# Altium project NODE.PrjPcb
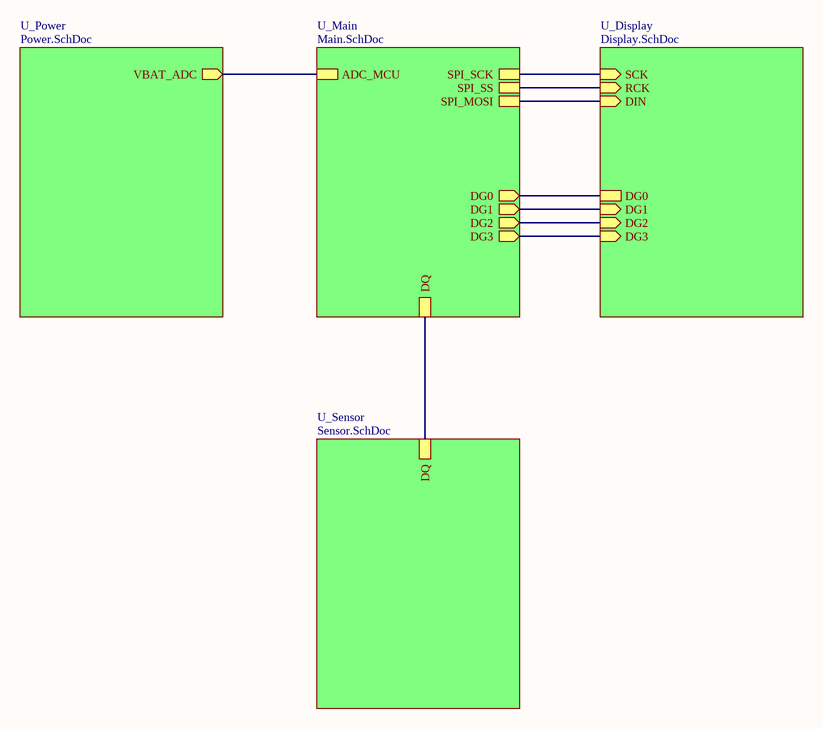
[diagram p0: CONN.SchDoc]
5 sheets, 69 parts. Net scope: hierarchical (ports join the sheet entries above them; power ports are global).
Board file: NODE.PcbDoc
Sheets:
  CONN.SchDoc
    U_Display = Display.SchDoc
    U_Power = Power.SchDoc
    U_Main = Main.SchDoc
    U_Sensor = Sensor.SchDoc

## Sheet CONN.SchDoc
size A3; SheetNumber: 1; SheetTotal: 5

### Sub-sheets
U_Display = Display.SchDoc: DIN (in), RCK (in), SCK (in), DG0, DG1 (in), DG2 (in), DG3 (in)
U_Main = Main.SchDoc: DQ, DG0 (out), DG1 (out), DG2 (out), DG3 (out), ADC_MCU, SPI_SCK, SPI_MOSI, SPI_SS
U_Power = Power.SchDoc: VBAT_ADC (out)
U_Sensor = Sensor.SchDoc: DQ

### Nets
p1.00: sheet U_Display/DG0, sheet U_Main/DG0
p1.01: sheet U_Display/DG1, sheet U_Main/DG1
p1.02: sheet U_Display/DG2, sheet U_Main/DG2
p1.03: sheet U_Display/DG3, sheet U_Main/DG3
NetC13_2: sheet U_Power/VBAT_ADC, sheet U_Main/ADC_MCU
NetIC1_2: sheet U_Main/DQ, sheet U_Sensor/DQ
NetU1_9: sheet U_Display/DIN, sheet U_Main/SPI_MOSI
NetU1_11: sheet U_Display/RCK, sheet U_Main/SPI_SS
NetU1_46: sheet U_Display/SCK, sheet U_Main/SPI_SCK

## Sheet Display.SchDoc
size A; SheetNumber: 3; SheetTotal: 4
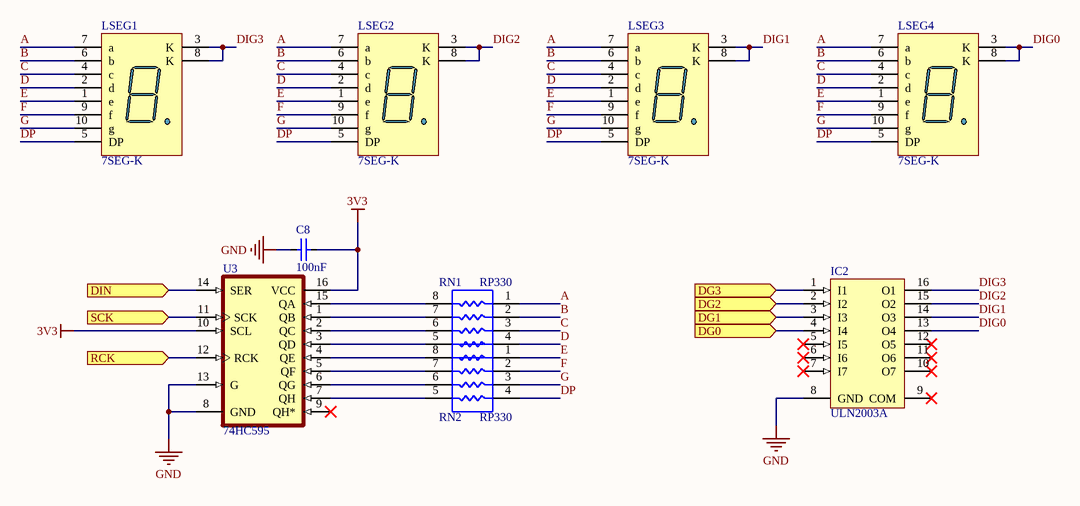
[diagram p1: Display.SchDoc]

### Parts
C8  100nF  [CAP_0805]
IC2  ULN2003A  [SOIC16]
LSEG1  7SEG-K  [LED7SEG]
LSEG2  7SEG-K  [LED7SEG]
LSEG3  7SEG-K  [LED7SEG]
LSEG4  7SEG-K  [LED7SEG]
RN1  RP330  [RN4-0805]
RN2  RP330  [RN4-0805]
U3  74HC595  [SOIC16]

### Ports
DG0 (in), DG1 (in), DG2 (in), DG3 (in), DIN (in), RCK (in), SCK (in)

### Nets
3V3: C8.1 U3.10(SCL) U3.16(VCC)
GND: C8.2 IC2.8(GND) U3.8(GND) U3.13(G)
A: LSEG1.7(a) LSEG2.7(a) LSEG3.7(a) LSEG4.7(a) RN1.1
B: LSEG1.6(b) LSEG2.6(b) LSEG3.6(b) LSEG4.6(b) RN1.2
C: LSEG1.4(c) LSEG2.4(c) LSEG3.4(c) LSEG4.4(c) RN1.3
D: LSEG1.2(d) LSEG2.2(d) LSEG3.2(d) LSEG4.2(d) RN1.4
DIG0: IC2.13(O4) LSEG4.3(K) LSEG4.8(K)
DIG1: IC2.14(O3) LSEG3.3(K) LSEG3.8(K)
DIG2: IC2.15(O2) LSEG2.3(K) LSEG2.8(K)
DIG3: IC2.16(O1) LSEG1.3(K) LSEG1.8(K)
DP: LSEG1.5(DP) LSEG2.5(DP) LSEG3.5(DP) LSEG4.5(DP) RN2.4
E: LSEG1.1(e) LSEG2.1(e) LSEG3.1(e) LSEG4.1(e) RN2.1
F: LSEG1.9(f) LSEG2.9(f) LSEG3.9(f) LSEG4.9(f) RN2.2
G: LSEG1.10(g) LSEG2.10(g) LSEG3.10(g) LSEG4.10(g) RN2.3
p1.00: IC2.4(I4) ; port DG0
p1.01: IC2.3(I3) ; port DG1
p1.02: IC2.2(I2) ; port DG2
p1.03: IC2.1(I1) ; port DG3
NetRN1_5: RN1.5 U3.3(QD)
NetRN1_6: RN1.6 U3.2(QC)
NetRN1_7: RN1.7 U3.1(QB)
NetRN1_8: RN1.8 U3.15(QA)
NetRN2_5: RN2.5 U3.7(QH)
NetRN2_6: RN2.6 U3.6(QG)
NetRN2_7: RN2.7 U3.5(QF)
NetRN2_8: RN2.8 U3.4(QE)
NetU1_9: U3.14(SER) ; port DIN
NetU1_11: U3.12(RCK) ; port RCK
NetU1_46: U3.11(SCK) ; port SCK

Not connected (* = marked no-connect by the designer): IC2 5(I5)* 6(I6)* 7(I7)* 9(COM)* 10(O7)* 11(O6)* 12(O5)*; U3 9(QH*)*

### Library data of the parts
C8 = CapSMD: Capacitor; Value: 33p; Published: 8-Jun-2000; LatestRevisionDate: 17-Jul-2002; LatestRevisionNote: Re-released for DXP Platform.; PackageReference: RAD-0.3; Publisher: Altium Limited
IC2 = ULN2003A: High-Voltage, High-Current Darlington Array; LatestRevisionNote: Stylized 3D Model Added.; Publisher: Altium Limited; Value: ULN2003A
LSEG1-LSEG4 = LED7SEG-K: 14.2 mm General Purpose Blue 7-Segment Display: CC, RH DP, Gray Surface; MinimumIntensity: 2020 ucd; Note: IF = 10 mA; Published: 8-Jun-2000; LatestRevisionDate: 17-Dec-2003; LatestRevisionNote: Schematic revised, PCB Footprint replaced.; DatasheetDocument: 24-Sep-2002; PackageDocument: 24-Sep-2002; PackageReference: H; Publisher: Altium Limited; Colour: Blue; ComponentLink1Description: Manufacturer Link; ComponentLink1URL: http://www.agilent.com/
RN1 RN2 = RN4-Dual
U3 = 74HC595: 8-bit Serial-Input/Serial or Parallel Output Shift Register with Latched 3-state Outputs

## Sheet Power.SchDoc
size A3; SheetNumber: 5; SheetTotal: 5
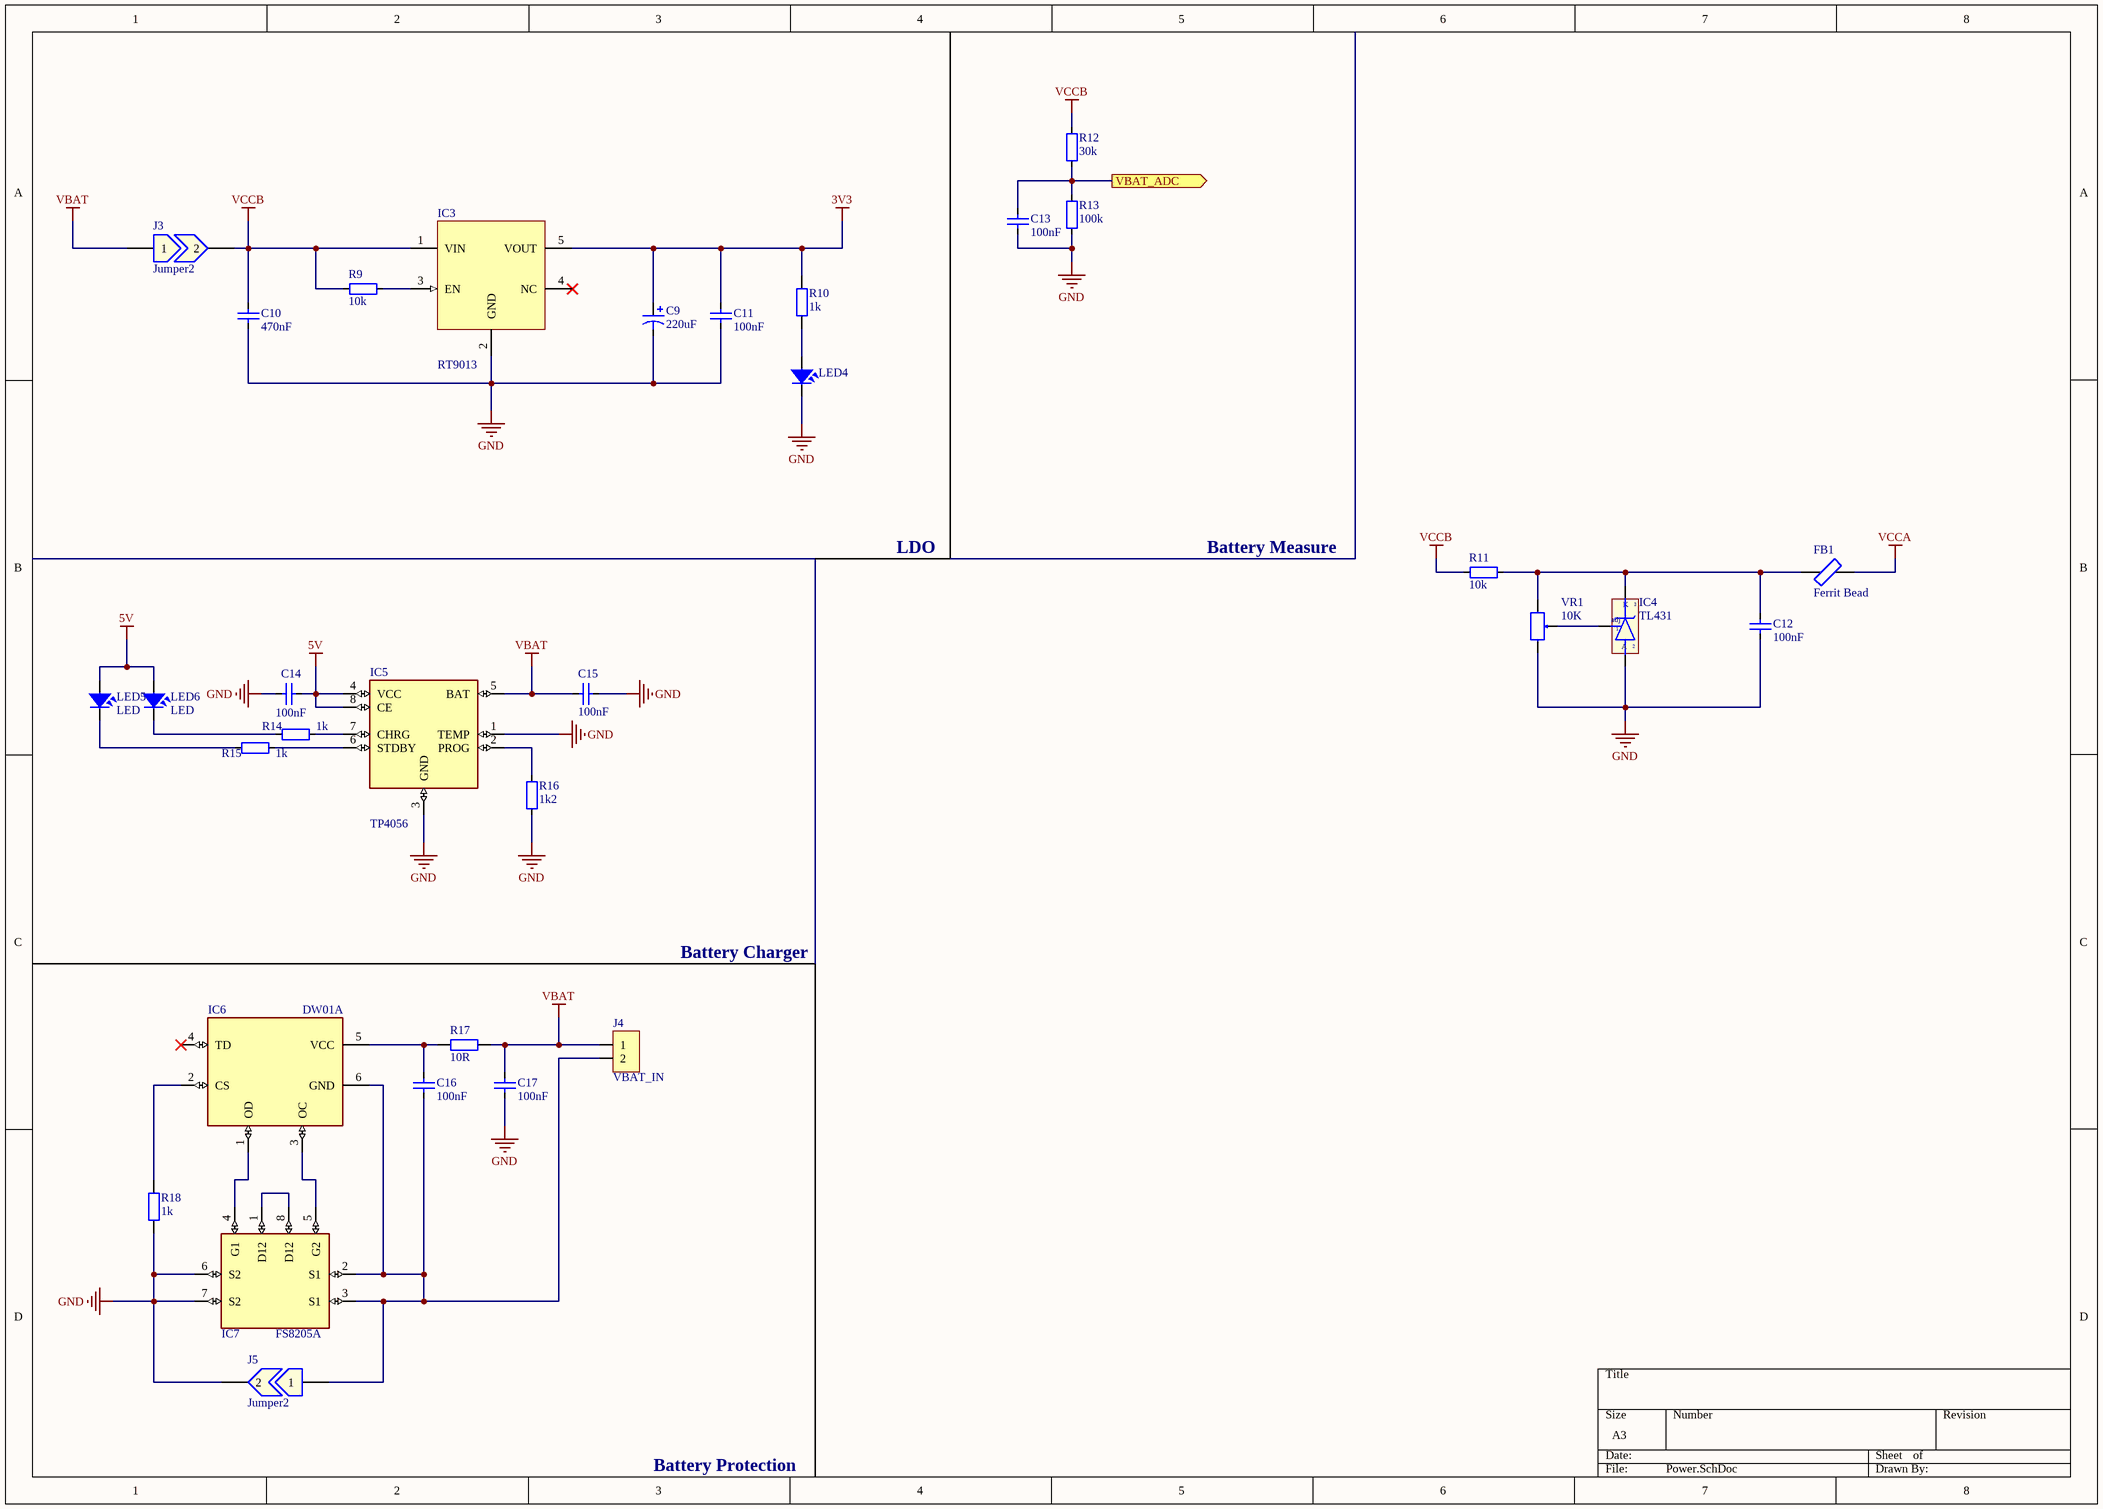
[diagram p2: Power.SchDoc]

### Parts
C9  220uF  [CAP_TANTALUM_3216]
C10  470nF  [CAP_0805]
C11  100nF  [CAP_0805]
C12  100nF  [CAP_0805]
C13  100nF  [CAP_0805]
C14  100nF  [CAP_0805]
C15  100nF  [CAP_0805]
C16  100nF  [CAP_0805]
C17  100nF  [CAP_0805]
FB1  Ferrit Bead  [RES-SMD-0805]
IC3  RT9013  [SOT23-5]
IC4  TL431  [qto-92]
IC5  TP4056  [TP4056]
IC6  DW01A  [SOT23-6]
IC7  FS8205A  [FS8205A]
J3  Jumper2  [JUMPER2]
J4  VBAT_IN  [JP2-D1T]
J5  Jumper2  [JUMPER2]
LED4  (no value)  [LED-0805-Red]
LED5  LED  [LED-0805-Red]
LED6  LED  [LED-0805-Green]
R9  10k  [RES-SMD-0805]
R10  1k  [RES-SMD-0805]
R11  10k  [RES-SMD-0805]
R12  30k  [RES-SMD-0805]
R13  100k  [RES-SMD-0805]
R14  1k  [RES-SMD-0805]
R15  1k  [RES-SMD-0805]
R16  1k2  [RES-SMD-0805]
R17  10R  [RES-SMD-0805]
R18  1k  [RES-SMD-0805]
VR1  10K  [VR1]

### Ports
VBAT_ADC (out)

### Nets
3V3: C9.1 C11.1 IC3.5(VOUT) R10.2
5V: C14.1 IC5.4(VCC) IC5.8(CE) LED5.1 LED6.1
GND: C9.2 C10.2 C11.2 C12.2 C13.1 C14.2 C15.1 C17.1 IC3.2(GND) IC4.2(A) IC5.1(TEMP) IC5.3(GND) IC7.6(S2) IC7.7(S2) J5.2 LED4.2 R13.2 R16.1 R18.2 VR1.3
VBAT: C15.2 C17.2 IC5.5(BAT) J3.1 J4.1 R17.2
VCCA: FB1.2
VCCB: C10.1 IC3.1(VIN) J3.2 R9.2 R11.2 R12.1
NetC12_1: C12.1 FB1.1 IC4.3(K) R11.1 VR1.1
NetC13_2: C13.2 R12.2 R13.1 ; port VBAT_ADC
NetC16_1: C16.1 IC6.6(GND) IC7.2(S1) IC7.3(S1) J4.2 J5.1
NetC16_2: C16.2 IC6.5(VCC) R17.1
NetIC3_3: IC3.3(EN) R9.1
NetIC4_1: IC4.1(adj) VR1.2
NetIC5_2: IC5.2(PROG) R16.2
NetIC5_6: IC5.6(STDBY) R15.1
NetIC5_7: IC5.7(CHRG) R14.1
NetIC6_1: IC6.1(OD) IC7.4(G1)
NetIC6_2: IC6.2(CS) R18.1
NetIC6_3: IC6.3(OC) IC7.5(G2)
NetIC7_1: IC7.1(D12) IC7.8(D12)
NetLED4_1: LED4.1 R10.1
NetLED5_2: LED5.2 R15.2
NetLED6_2: LED6.2 R14.2

Not connected (* = marked no-connect by the designer): IC3 4(NC)*; IC6 4(TD)*

### Notes on the sheet
- LDO
- Battery Measure
- Battery Charger
- Battery Protection

### Library data of the parts
C9 = Cap Pol: Polarized Capacitor (Axial); Published: 8-Jun-2000; LatestRevisionDate: 17-Jul-2002; LatestRevisionNote: Re-released for DXP Platform.; PackageReference: POLAR0.8; Publisher: Altium Limited
C10-C17 = CapSMD: Capacitor; Value: 33p; Published: 8-Jun-2000; LatestRevisionDate: 17-Jul-2002; LatestRevisionNote: Re-released for DXP Platform.; PackageReference: RAD-0.3; Publisher: Altium Limited
FB1 = Ferrit Bead: Generic Ferrit Bead
IC3 = RT9013: https://linhkien.cxt.vn/5435-rt9013-33gb-ic-reg-linear-33v-500ma-sot23-5.html
IC4 = TL431: Programmable Shunt Regulator; Value: TL431
IC5 = TP4056: Complete single cell Li-Ion battery with a constant current / constant voltage linear charger
IC6 = DW01A: One Cell Lithium-ion/Polymer Battery Protection IC
J3 J5 = Jumper2: Jumper, 2-Pin
J4 = JP2: WR-PHD 2.54 mm Angled Socket Header; Manufacturer: W¨¹rth Elektronik eiSos GmbH; partNo: 613002143121; ComponentLink1 Description: Manufacturer; ComponentLink2 Description: Datasheet; NoPins: 02; Created Date: 29 March 2013; ComponentLink1URL: http://www.we-online.com; ComponentLink2URL: http://katalog.we-online.de/em/datasheet/6130xx143121.pdf; Created by: Karrer Zheng
LED4-LED6 = LED: LED Single colour Green and Red; Value: LED 3 ly Single Colour
R9 R11-R16 = Resistor - SMD: Resistor; Manufacturer: Generic Components; Class: Passive; Published: 08/06/2000; Publisher: Altium Hobart Technology Centre
R10 R17 R18 = Resistor - SMD: Resistor SMD; Manufacturer: Generic Components; Class: Passive; Published: 08/06/2000; Publisher: Altium Hobart Technology Centre
VR1 = VR: Var Resistor; Value: VR 10K

## Sheet Main.SchDoc
size A; SheetNumber: 2; SheetTotal: 5
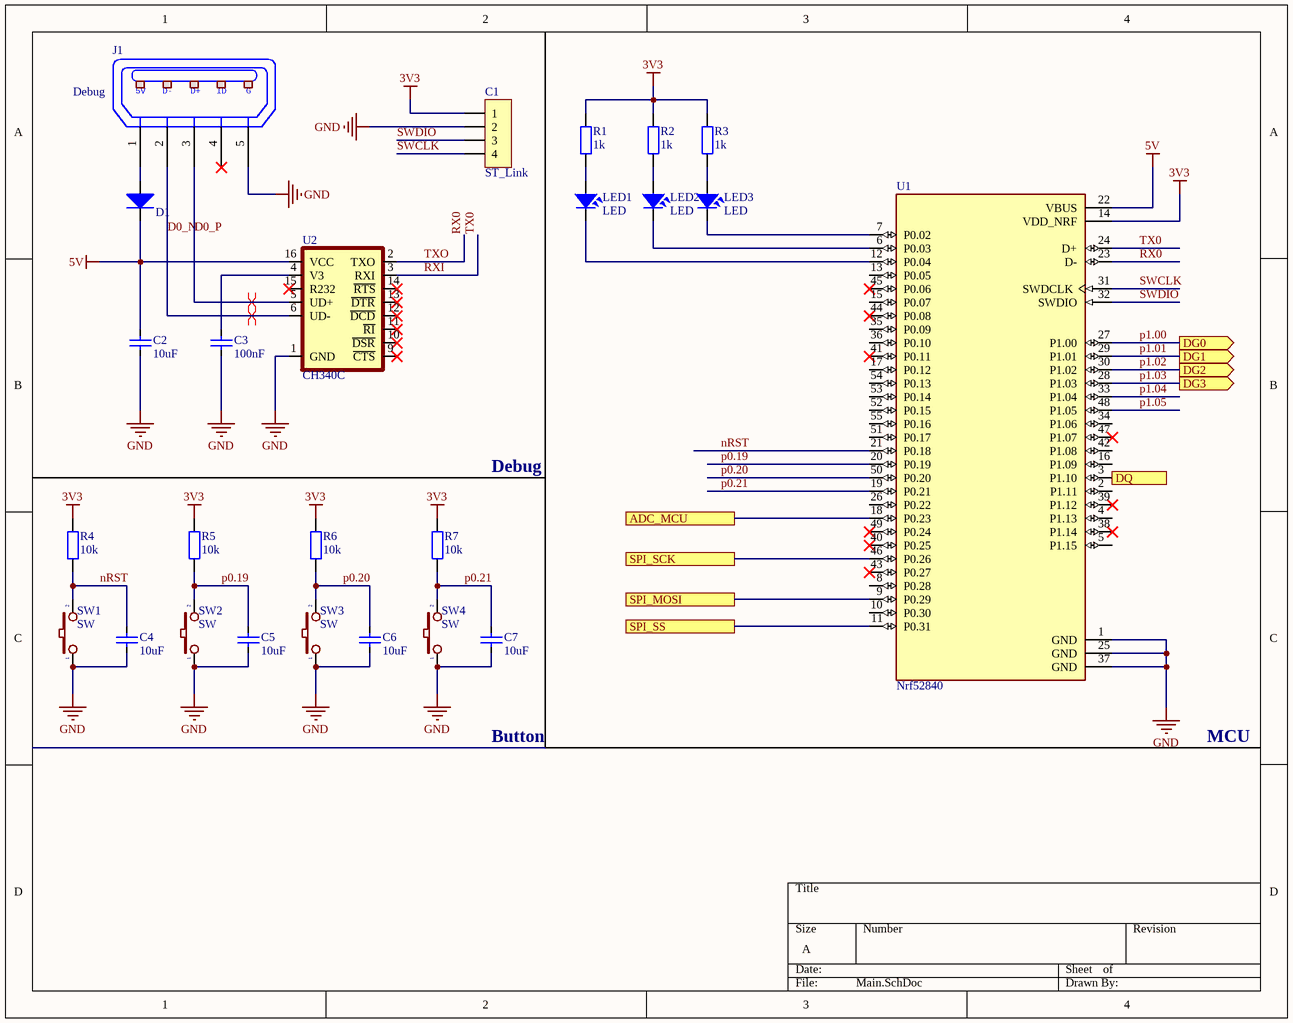
[diagram p3: Main.SchDoc]

### Parts
C1  ST_Link  [J4-D1T]
C2  10uF  [CAP_0805]
C3  100nF  [CAP_0805]
C4  10uF  [CAP_0805]
C5  10uF  [CAP_0805]
C6  10uF  [CAP_0805]
C7  10uF  [CAP_0805]
D1  Diode SMD  [DIO-214AC(SMA)]  (value not drawn)
J1  Debug  [USB-M1]
LED1  LED  [LED-0805-Red]
LED2  LED  [LED-0805-Yellow]
LED3  LED  [LED-0805-Green]
R1  1k  [RES-SMD-0805]
R2  1k  [RES-SMD-0805]
R3  1k  [RES-SMD-0805]
R4  10k  [RES-SMD-0805]
R5  10k  [RES-SMD-0805]
R6  10k  [RES-SMD-0805]
R7  10k  [RES-SMD-0805]
SW1  SW  [SW 3x2x4]
SW2  SW  [SW2]
SW3  SW  [SW2]
SW4  SW  [SW2]
U1  Nrf52840  [NRF52840]
U2  CH340C  [SOP-16]

### Ports
ADC_MCU, DG0 (out), DG1 (out), DG2 (out), DG3 (out), DQ, SPI_MOSI, SPI_SCK, SPI_SS

### Nets
3V3: C1.1 R1.1 R2.1 R3.1 R4.1 R5.1 R6.1 R7.1 U1.14(VDD_NRF)
5V: C2.2 D1.2(K) U1.22(VBUS) U2.16(VCC)
GND: C1.2 C2.1 C3.1 C4.1 C5.1 C6.1 C7.1 J1.5(P5) SW1.1 SW2.1 SW3.1 SW4.1 U1.1(GND) U1.25(GND) U1.37(GND) U2.1(GND)
D0_N: J1.2(P2) U2.6(UD-)
D0_P: J1.3(P3) U2.5(UD+)
nRST: C4.2 R4.2 SW1.2 U1.21(P0.18)
p0.19: C5.2 R5.2 SW2.2 U1.20(P0.19)
p0.20: C6.2 R6.2 SW3.2 U1.50(P0.20)
p0.21: C7.2 R7.2 SW4.2 U1.19(P0.21)
p1.00: U1.27(P1.00) ; port DG0
p1.01: U1.29(P1.01) ; port DG1
p1.02: U1.30(P1.02) ; port DG2
p1.03: U1.28(P1.03) ; port DG3
p1.04: U1.33(P1.04)
p1.05: U1.48(P1.05)
RX0: U1.23(D-) U2.2(TXO)  [also labelled TXO]
RXI: U1.24(D+) U2.3(RXI)  [also labelled TX0]
SWCLK: C1.4 U1.31(SWDCLK)
SWDIO: C1.3 U1.32(SWDIO)
NetC3_2: C3.2 U2.4(V3)
NetC13_2: U1.18(P0.23) ; port ADC_MCU
NetD1_1: D1.1(A) J1.1(P1)
NetIC1_2: U1.3(P1.10) ; port DQ
NetLED1_1: LED1.1 R1.2
NetLED1_2: LED1.2 U1.12(P0.04)
NetLED2_1: LED2.1 R2.2
NetLED2_2: LED2.2 U1.6(P0.03)
NetLED3_1: LED3.1 R3.2
NetLED3_2: LED3.2 U1.7(P0.02)
NetU1_9: U1.9(P0.29) ; port SPI_MOSI
NetU1_11: U1.11(P0.31) ; port SPI_SS
NetU1_46: U1.46(P0.26) ; port SPI_SCK

Not connected (* = marked no-connect by the designer): J1 4(P4)*; U1 2(P1.11) 4(P1.13) 5(P1.15) 8(P0.28) 10(P0.30) 13(P0.05) 15(P0.07) 16(P1.09) 17(P0.12) 26(P0.22) 34(P1.06) 35(P0.09) 36(P0.10) 38(P1.14)* 39(P1.12)* 40(P0.25)* 41(P0.11)* 42(P1.08) 43(P0.27)* 44(P0.08)* 45(P0.06)* 47(P1.07)* 49(P0.24)* 51(P0.17) 52(P0.15) 53(P0.14) 54(P0.13) 55(P0.16); U2 9(~{CTS})* 10(~{DSR})* 11(~{RI})* 12(~{DCD})* 13(~{DTR})* 14(~{RTS})* 15(R232)*

### Layout directives
differential pair: D0_N, D0_P

### Notes on the sheet
- Debug
- Button
- MCU
- (in symbol USB-5) 5V; D-; D+; ID; G

### Library data of the parts
C1 = JP4x1-2.0: WR-PHD 2.00 mm Socket Header; Manufacturer: W¨¹rth Elektronik eiSos GmbH; partNo: 62000411821; ComponentLink1 Description: Manufacturer; ComponentLink2 Description: Datasheet; NoPins: 04; Created Date: 2 April 2013; ComponentLink1URL: http://www.we-online.com; ComponentLink2URL: http://katalog.we-online.de/em/datasheet/6200xx11821.pdf; Created by: Karrer Zheng
C2-C7 = CapSMD: Capacitor; Value: 33p; Published: 8-Jun-2000; LatestRevisionDate: 17-Jul-2002; LatestRevisionNote: Re-released for DXP Platform.; PackageReference: RAD-0.3; Publisher: Altium Limited
D1 = Diode SMD: Default Diode; Code - JEDEC: DO-214-AB; Value: 1N5007; Published: 8-Jun-2000; Revision: July-2002: Re-released for DXP Platform.; Publisher: Altium Limited
J1 = USB-5: Manufacturer: FCI; Manufacturer Part Number: 10118193-0001LF; Connector Type: USB - micro B; Number of Contacts: 5; Gender: Receptacle; Specifications: USB 2.0; .Creator: MM; .Checked PCB: RF; Supplier 1: Digi-Key; RoHS: RoHS Compliant; Category: Connectors, Interconnects; Stock 1: 28642; Pricing 1: 1=0.46, 10=0.433, 25=0.3712, 50=0.3156, 100=0.3032, 250=0.27224, 500=0.25988 (USD); Packaging: Cut Tape (CT); Mounting Type: Surface Mount, Right Angle, Horizontal; Features: Shielded, Solder Retention; Ingress Protection: -; ComponentLink1URL: http://portal.fciconnect.com/Comergent//fci/drawing/10118193.pdf; ComponentLink1Description: http://portal.fciconnect.com/Comergent//fci/drawing/10118193.pdf; Supplier Part Number 1: 609-4616-1-ND; .Checked SCH: MM
LED1-LED3 = LED: as LED4 on sheet Power
R1-R7 = Resistor - SMD: as R10 on sheet Power; Published: 08/06/2000; Publisher: Altium Hobart Technology Centre
SW1-SW4 = SW2: Switch button 2 pin; Value: SW chip 2 pin
U1 = Nrf52840: Module SoC
U2 = CH340C: USB to serial chip CH340; MF: WCH; Package: Package; Check_prices: https://www.snapeda.com/parts/CH340C/WCH/view-part/5428851/?ref=eda; Value: *; Price: None; MP: CH340C; Availability: Unavailable; SnapEDA_Link: https://www.snapeda.com/parts/CH340C/WCH/view-part/5428851/?ref=snap

## Sheet Sensor.SchDoc
size A; SheetNumber: 3; SheetTotal: 5
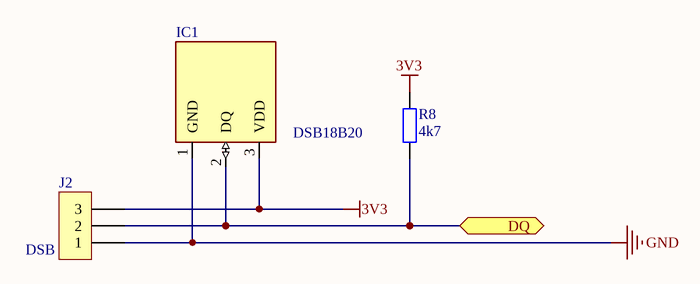
[diagram p4: Sensor.SchDoc]

### Parts
IC1  DSB18B20  [TO-92]
J2  DSB  [KF3-5.08]
R8  4k7  [RES-SMD-0805]

### Ports
DQ (bidir)

### Nets
3V3: IC1.3(VDD) J2.3 R8.2
GND: IC1.1(GND) J2.1
NetIC1_2: IC1.2(DQ) J2.2 R8.1 ; port DQ

### Library data of the parts
IC1 = DSB18B20: https://linhkien.cxt.vn/3083-ds18b20-temperature-sensors-55-to-125-c-to-92-3.html
J2 = KF3: Manufacturer: Würth Elektronik eiSos GmbH; partNo: 691103110003; ComponentLink1 Description: Manufacturer; ComponentLink2 Description: Datasheet; NoPins: 3; Created Date: 29 October 2013; ComponentLink1URL: http://www.we-online.com; ComponentLink2URL: http://katalog.we-online.de/em/datasheet/6911031100xx.pdf; Created by: Karrer Zheng
R8 = Resistor - SMD: as R10 on sheet Power; Published: 08/06/2000; Publisher: Altium Hobart Technology Centre

## Nets that join several sheets
3V3: Display (C8.1 U3.10 U3.16), Power (C9.1 C11.1 IC3.5 R10.2), Main (9 pins), Sensor (IC1.3 J2.3 R8.2)
5V: Power (5 pins), Main (C2.2 D1.2 U1.22 U2.16)
GND: Display (C8.2 IC2.8 U3.8 U3.13), Power (20 pins), Main (16 pins), Sensor (IC1.1 J2.1)
NetC13_2: Power (C13.2 R12.2 R13.1), Main (U1.18)
NetIC1_2: Main (U1.3), Sensor (IC1.2 J2.2 R8.1)
NetU1_9: Display (U3.14), Main (U1.9)
NetU1_11: Display (U3.12), Main (U1.11)
NetU1_46: Display (U3.11), Main (U1.46)
p1.00: Display (IC2.4), Main (U1.27)
p1.01: Display (IC2.3), Main (U1.29)
p1.02: Display (IC2.2), Main (U1.30)
p1.03: Display (IC2.1), Main (U1.28)